# EAGLE design Module1 (EAGLE 7.5.0)
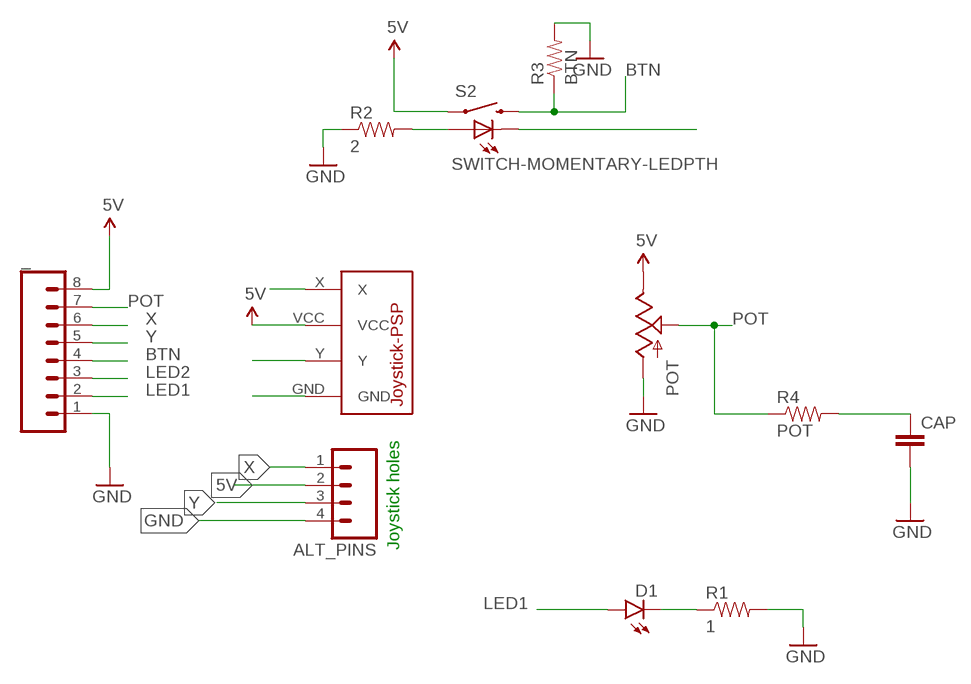
[diagram p0: schematic, sheet 1]

## Parts
_  M08  [1X08_ROUND]
ALT_PINS  M04NO_SILK_ALL_ROUND  [1X04_NO_SILK_ALL_ROUND]
CAP  CAPEZ  [CAP-PTH-SMALLEZ]
D1  LED3MM  [LED3MM]
POT  POT100K_3362U  [3362U]
R1  1  10KOHM-1/6W-5%(PTH)KIT  [AXIAL-0.3-KIT]
R2  2  10KOHM-1/6W-5%(PTH)KIT  [AXIAL-0.3-KIT]
R3  BTN  10KOHM-1/6W-5%(PTH)KIT  [AXIAL-0.3-KIT]
R4  POT  10KOHM-1/6W-5%(PTH)KIT  [AXIAL-0.3-KIT]
S2  SWITCH-MOMENTARY-LEDPTH  [TACTILE-PTH-LED-12MM]
U$1  JOYSTICK-PSP1000  [JOYSTICK-PSP1000]

## Nets
5V: _.8 ALT_PINS.2 POT.P$1(E) S2.4 U$1.VCC
BTN: _.4 R3.P$1 S2.2
GND: _.1 ALT_PINS.4 CAP.2 POT.P$3(A) R1.P$2 R2.P$1 R3.P$2 U$1.GND
LED1: _.2 D1.A
LED2: _.3 S2.C
N$1: D1.K(C) R1.P$1
N$2: R2.P$2 S2.A
N$3: CAP.1 R4.P$2
POT: _.7 POT.P$2(S) R4.P$1
X: _.6 ALT_PINS.1 U$1.X
Y: _.5 ALT_PINS.3 U$1.Y

## Notes on the sheet
- Joystick holes

## Library data of the parts
_ = SparkFun-Connectors:M08: Header 8 Standard 8-pin 0.1" header. Use with straight break away headers (SKU : PRT-00116), right angle break away headers (PRT-00553), swiss pins (PRT-00743), machine pins (PRT-00117), and female headers (PRT-00115).; PROD_ID: CONN-08437
ALT_PINS = SparkFun-Connectors:M04: Header 4 Standard 4-pin 0.1" header. Use with straight break away headers (SKU : PRT-00116), right angle break away headers (PRT-00553), swiss pins (PRT-00743), machine pins (PRT-00117), and female headers (PRT-00115). Molex polarized connector foot print use with SKU : PRT-08231 with associated crimp pins and housings. 1MM SMD Version SKU: PRT-10208; PROD_ID: CONN-09696
CAP = SparkFun-Capacitors:CAP: Capacitor Standard 0603 ceramic capacitor, and 0.1" leaded capacitor.
D1 = SparkFun-LED:LED: LEDs Standard schematic elements and footprints for 5mm, 3mm, 1206, and 0603 sized LEDs. 5mm - Spark Fun Electronics SKU : COM-00529 (and others); PROD_ID: DIO-08794
POT = SparkFun-Electromechanical:POT
R1-R4 = SparkFun-Resistors:10KOHM-1/6W-5%(PTH): RES-08375; PROD_ID: RES-08375
S2 = Local Library:SWITCH-MOMENTARY-LED
U$1 = SparkFun-Electromechanical:JOYSTICK-PSP1000: This is a footprint for the PSP-1000 Joystick. 4-pins: X, Y, Vcc and GND

## Net classes
0 default: width 0.635 mm, drill 0.254 mm, clearance 0.381 mm
1 5V: width 0.635 mm, drill 0.254 mm, clearance 0.381 mm

## Board
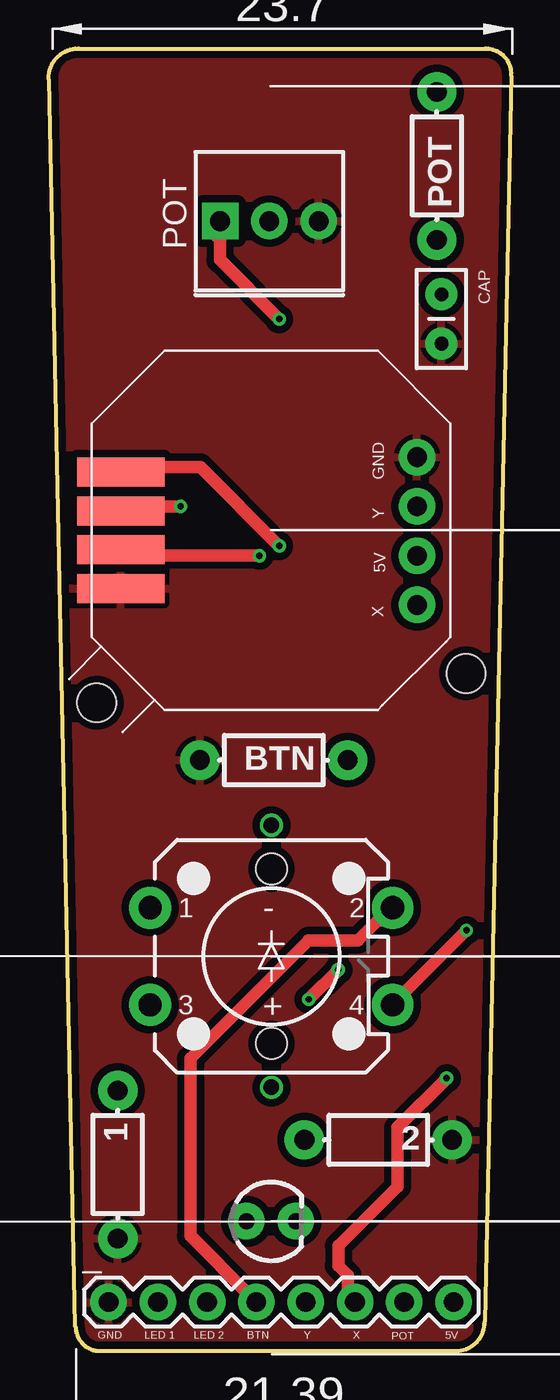
[diagram p1: board, top side]
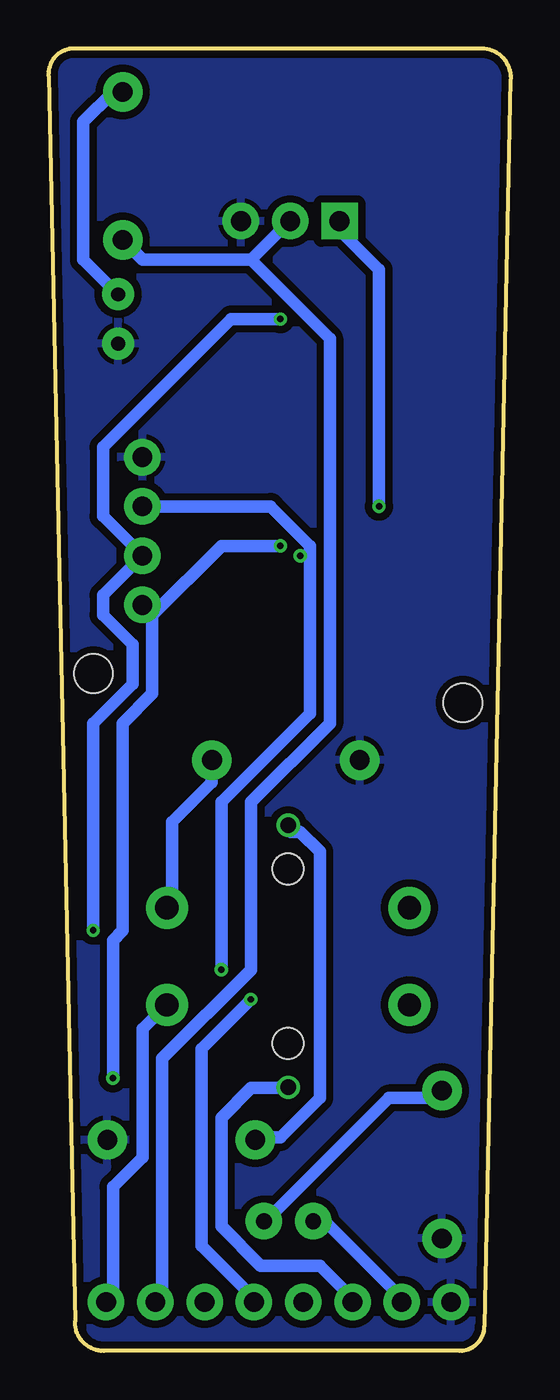
[diagram p2: board, bottom side, seen from below]

Size 23.85 x 67.11 mm. Coordinates in mm from the lower left corner, seen from the top.
Outline: 1.4,1.32 1.4,1.26 arc90 2.66,0 21,0 arc90 22.48,1.48
Outline: 0,65.58 arc-90 1.53,67.11 22.54,67.11 arc-90 23.85,65.8
Outline: 1.36,1.29 0.03,65.49
Outline: 23.85,65.72 22.48,1.52
Copper layers (1*16): Top 0.0356mm / dielectric 1.5011mm / Bottom 0.0356mm
Design rules "LaenPCBOrder": minimum track width 6mil, minimum drill 13mil, track to track 6mil, track to pad 6mil, pad to pad 6mil, via to via 6mil, smd to smd 6mil, copper to edge 15mil, drill to drill 6mil, minimum pad ring 7mil, minimum via ring 7mil, stop-mask expansion 3mil, vias tented up to drill 0mil, thermal gap 10mil

### Footprints (pad centres in the part's own frame; a part is rotated, then mirrored left to right if it is on the bottom)
1X08_ROUND = drill 1.016 pad 1.88: 1 0,0; 2 2.54,0; 3 5.08,0; 4 7.62,0; 5 10.16,0; 6 12.7,0; 7 15.24,0; 8 17.78,0
1X04_NO_SILK_ALL_ROUND = drill 1.016 pad 1.88: 1 0,0; 2 2.54,0; 3 5.08,0; 4 7.62,0
CAP-PTH-SMALLEZ = drill 0.7 pad 1.651: 1 0,0; 2 2.54,0
LED3MM = drill 0.813 pad 1.88: A -1.27,0; K 1.27,0
3362U = drill 1.016 pad 1.88 square: P$1 0,2.54 | drill 1.016 pad 1.88: P$2 2.54,2.54; P$3 5.08,2.54
AXIAL-0.3-KIT = drill 1.016 pad 2.032: P$1 -3.81,0; P$2 3.81,0
TACTILE-PTH-LED-12MM = drill 1.2 pad 2.159: 1 -6.25,2.5; 2 6.25,2.5; 3 -6.25,-2.5; 4 6.25,-2.5 | drill 0.8: A 0,6.75; C 0,-6.75 | hole 1.6: 0,4.5; 0,-4.5
JOYSTICK-PSP1000 = smd 1.5 x 4.5: GND -3,7.75; VCC 1,7.75; X 3,7.75; Y -1,7.75 | hole 2: -8.89,8.985; -7.375,-10.06

### Placement (x,y rotation side)
_  3.1,2.52 0 top
ALT_PINS  19,38.44 90 top
CAP  20.26,54.44 270 top
D1  11.47,6.69 0 top
POT  8.85,55.67 0 top
R1  3.57,9.61 270 top
R2  17,10.88 180 top
R3  11.61,30.45 180 top
R4  20.02,61.06 90 top
S2  11.49,20.34 0 top
U$1  11.47,42.28 90 top

### Tracks (layer width: path | path; a pad name or v marks a point on that pad's centre or on a via)
5V  (via drill 0.33)
  Top 0.635: v11.89,53.17 8.84,56.22 8.84,57.23 8.33,57.74 8.84,58.25 POT.P$1 | v6.81,43.52 3.76,43.52 U$1.VCC | v21.54,21.67 17.99,18.12 S2.4
  Bottom 0.635: _.8 20.53,2.88 20.53,8.46 19,9.99 19,16.59 17.99,17.61 S2.4 | v11.89,53.17 14.43,53.17 21.03,46.56 21.03,43.01 ALT_PINS.2 21.03,38.94 21.03,37.93 19.51,36.4 19.51,34.37 21.54,32.34 v21.54,21.67 | v6.81,43.52 6.81,55.71 8.84,57.74 POT.P$1
BTN
  Top 0.635: _.4 10.37,2.88 7.32,5.92 7.32,15.07 13.41,21.16 15.95,21.16 16.97,22.18 17.48,22.18 17.99,22.69 S2.2
  Bottom 0.635: R3.P$1 15.45,30.31 15.45,29.29 17.48,27.26 17.48,23.2 S2.2
GND
  pour Top: 0.26,66.97 23.91,66.85 22.43,0 1.54,-0.03
  pour Bottom: 0.26,66.97 23.91,66.85 22.43,0 1.51,0
LED1
  Bottom 0.635: _.2 5.79,2.88 9.86,6.94 D1.A
LED2
  Bottom 0.635: S2.C 11.89,13.54 13.41,13.54 14.94,12.02 14.94,6.43 12.91,4.4 9.86,4.4 8.33,2.88 _.3
N$1
  Bottom 0.635: D1.K 12.4,6.94 6.3,13.04 3.76,13.04 R1.P$1
N$2
  Bottom 0.635: S2.A 11.38,26.75 10.87,26.75 9.86,25.74 9.86,13.04 11.89,11 12.91,11 R2.P$2
N$3
  Bottom 0.635: CAP.1 20.53,54.69 22.05,56.22 22.05,63.33 20.53,64.85 R4.P$2
POT
  Bottom 0.635: 13.41,56.22 11.89,57.74 POT.P$2 | 13.41,56.22 19,56.22 20.02,57.23 R4.P$1 | 13.41,56.22 9.35,52.15 9.35,32.34 13.41,28.28 13.41,19.64 17.99,15.07 17.99,2.88 _.7
X  (via drill 0.33)
  Top 0.635: v20.53,14.05 17.99,11.51 17.99,8.46 14.94,5.42 14.94,4.4 15.45,3.89 15.45,2.88 _.6 | v11.89,41.48 7.83,45.55 3.76,45.55 U$1.X
  Bottom 0.635: v20.53,14.05 20.53,21.16 20.02,21.67 20.02,32.34 18.49,33.86 18.49,37.93 | v11.89,41.48 14.94,41.48 18.49,37.93 | 18.49,37.93 ALT_PINS.1
Y  (via drill 0.33)
  Top 0.635: v14.94,19.64 v13.41,18.12 | v10.87,40.98 3.76,40.98 U$1.Y
  Bottom 0.635: v13.41,18.12 15.95,15.58 15.95,5.42 13.41,2.88 _.5 | v14.94,19.64 14.94,28.28 10.37,32.85 10.37,40.98 | 10.37,40.98 10.37,41.48 12.4,43.52 ALT_PINS.3 | 10.37,40.98 v10.87,40.98

### Text on the board
tPlace: GND | Y | 5V | X | GND | LED 1 | LED 2 | BTN | Y | X | POT | 5V